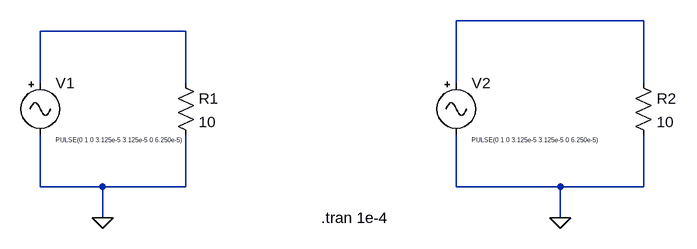
[diagram p0: schematic Waveforms.asc]
Waveforms.asc, the LTspice schematic file:
Version 4
SHEET 1 1016 680
WIRE 784 128 496 128
WIRE 80 144 -144 144
WIRE -144 224 -144 144
WIRE 80 224 80 144
WIRE 496 224 496 128
WIRE 784 224 784 128
WIRE -144 384 -144 304
WIRE -48 384 -144 384
WIRE 80 384 80 304
WIRE 80 384 -48 384
WIRE 496 384 496 304
WIRE 656 384 496 384
WIRE 784 384 784 304
WIRE 784 384 656 384
WIRE -48 432 -48 384
WIRE 656 432 656 384
FLAG -48 432 0
FLAG 656 432 0
SYMBOL signal -144 208 R0
WINDOW 3 24 104 Left 0
SYMATTR InstName V1
SYMATTR Value PULSE(0 1 0 3.125e-5 3.125e-5 0 6.250e-5)
SYMBOL signal 496 208 R0
WINDOW 3 24 104 Left 0
SYMATTR InstName V2
SYMATTR Value PULSE(0 1 0 3.125e-5 3.125e-5 0 6.250e-5)
SYMBOL res 64 208 R0
SYMATTR InstName R1
SYMATTR Value 10
SYMBOL res 768 208 R0
SYMATTR InstName R2
SYMATTR Value 10
TEXT 288 432 Left 2 !.tran 1e-4

The netlist it stands for:
* Waveforms.asc
V1 N002 0 PULSE(0 1 0 3.125e-5 3.125e-5 0 6.250e-5)
V2 N001 0 PULSE(0 1 0 3.125e-5 3.125e-5 0 6.250e-5)
R1 N002 0 10
R2 N001 0 10
.tran 1e-4
.backanno
.end